# Altium schematic sheet [1] Table of Contents.SchDoc: =DocumentName
size A3; Organization: ORGANIZATION; Address1: R. Aprígio Veloso, 882, Universitário; Address2: Campina Grande - PB; Address3: 58429-900; DocumentNumber: 1; Revision: -; SheetNumber: 1; SheetTotal: 9; ENG_DATE: --/--/--; DSN_DATE: --/--/--; CHK_DATE: --/--/--; SCH_SCALE: 1:1
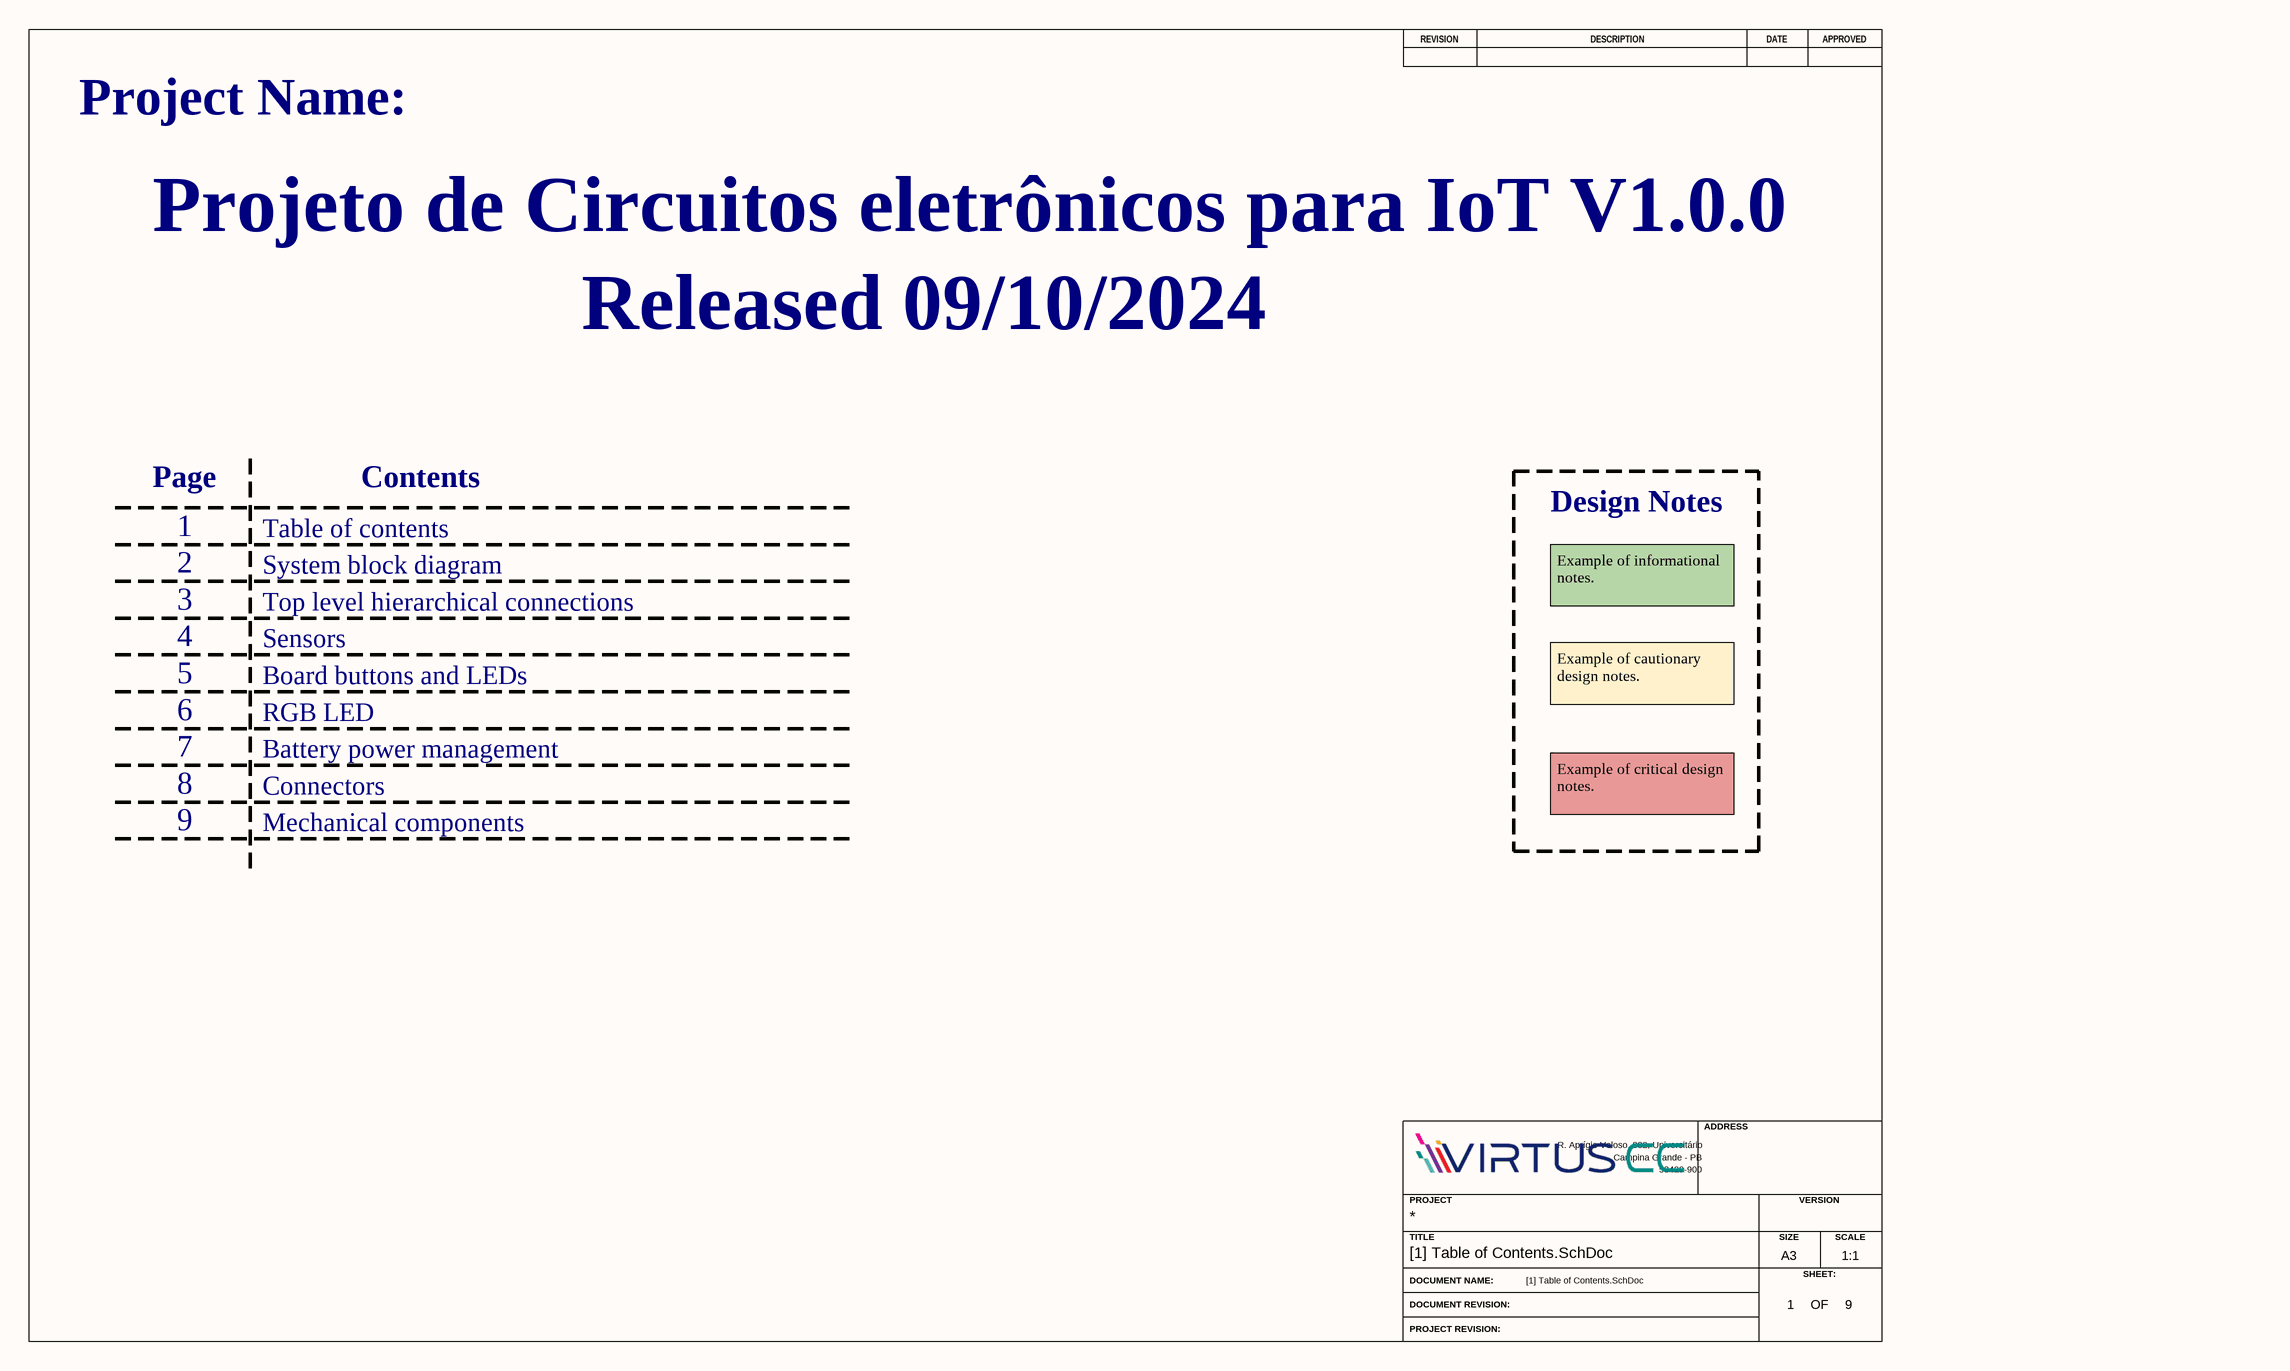
[diagram p0: [1] Table of Contents.SchDoc]

## Notes on the sheet
- Project Name:
- Projeto de Circuitos eletrônicos para IoT V1.0.0
- Released 09/10/2024
- Page
- Contents
- Design Notes
- 1
- 2
- Table of contents
- System block diagram
- 3
- 4
- Top level hierarchical connections
- Sensors
- Example of informational notes.
- 5
- Board buttons and LEDs
- Example of cautionary design notes.
- 6
- 7
- RGB LED
- Battery power management
- 8
- 9
- Connectors
- Mechanical components
- Example of critical design notes.
- REVISION
- DESCRIPTION
- DATE
- APPROVED
- ADDRESS
- PROJECT
- VERSION
- TITLE
- A3
- SIZE
- SCALE
- DOCUMENT NAME:
- DOCUMENT REVISION:
- OF
- SHEET:
- PROJECT REVISION: